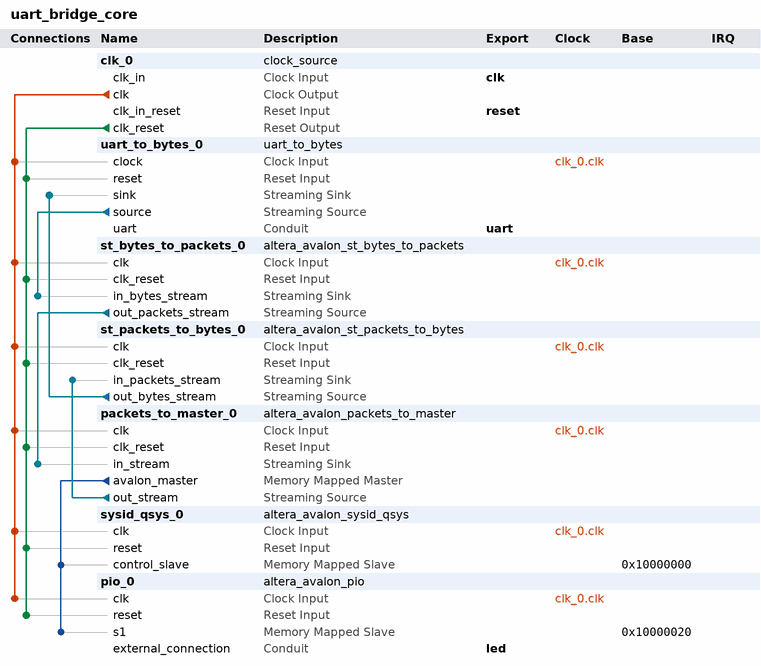
[diagram p0: system contents]
# Platform Designer (Qsys) system uart_bridge_core, Cyclone IV E EP4CE6E22C8
# Parameters at their usual value, and those the tool derives, are not listed.
package require -exact qsys 22.1
create_system uart_bridge_core
set_project_property DEVICE_FAMILY {Cyclone IV E}
set_project_property DEVICE EP4CE6E22C8

add_instance clk_0 clock_source 22.1
set_instance_parameter_value clk_0 clockFrequency 50000000

add_instance uart_to_bytes_0 uart_to_bytes 1.0
set_instance_parameter_value uart_to_bytes_0 CLOCK_FREQUENCY 50000000
set_instance_parameter_value uart_to_bytes_0 UART_BAUDRATE 115200
set_instance_parameter_value uart_to_bytes_0 UART_STOPBIT 1

add_instance st_bytes_to_packets_0 altera_avalon_st_bytes_to_packets 22.1
set_instance_parameter_value st_bytes_to_packets_0 CHANNEL_WIDTH 8
set_instance_parameter_value st_bytes_to_packets_0 ENCODING 0

add_instance st_packets_to_bytes_0 altera_avalon_st_packets_to_bytes 22.1
set_instance_parameter_value st_packets_to_bytes_0 CHANNEL_WIDTH 8
set_instance_parameter_value st_packets_to_bytes_0 ENCODING 0

add_instance packets_to_master_0 altera_avalon_packets_to_master 22.1
set_instance_parameter_value packets_to_master_0 EXPORT_MASTER_SIGNALS 0
set_instance_parameter_value packets_to_master_0 FAST_VER 0
set_instance_parameter_value packets_to_master_0 FIFO_DEPTHS 2

add_instance sysid_qsys_0 altera_avalon_sysid_qsys 22.1
set_instance_parameter_value sysid_qsys_0 id 1923088385

add_instance pio_0 altera_avalon_pio 22.1
set_instance_parameter_value pio_0 direction Output
set_instance_parameter_value pio_0 width 2

# connections
add_connection clk_0.clk packets_to_master_0.clk clock
add_connection clk_0.clk pio_0.clk clock
add_connection clk_0.clk st_bytes_to_packets_0.clk clock
add_connection clk_0.clk st_packets_to_bytes_0.clk clock
add_connection clk_0.clk sysid_qsys_0.clk clock
add_connection clk_0.clk uart_to_bytes_0.clock clock
add_connection clk_0.clk_reset packets_to_master_0.clk_reset reset
add_connection clk_0.clk_reset pio_0.reset reset
add_connection clk_0.clk_reset st_bytes_to_packets_0.clk_reset reset
add_connection clk_0.clk_reset st_packets_to_bytes_0.clk_reset reset
add_connection clk_0.clk_reset sysid_qsys_0.reset reset
add_connection clk_0.clk_reset uart_to_bytes_0.reset reset
add_connection packets_to_master_0.avalon_master pio_0.s1 avalon
set_connection_parameter_value packets_to_master_0.avalon_master/pio_0.s1 baseAddress 0x10000020
add_connection packets_to_master_0.avalon_master sysid_qsys_0.control_slave avalon
set_connection_parameter_value packets_to_master_0.avalon_master/sysid_qsys_0.control_slave baseAddress 0x10000000
add_connection packets_to_master_0.out_stream st_packets_to_bytes_0.in_packets_stream avalon_streaming
add_connection st_bytes_to_packets_0.out_packets_stream packets_to_master_0.in_stream avalon_streaming
add_connection st_packets_to_bytes_0.out_bytes_stream uart_to_bytes_0.sink avalon_streaming
add_connection uart_to_bytes_0.source st_bytes_to_packets_0.in_bytes_stream avalon_streaming

# exported interfaces
add_interface clk clock sink
set_interface_property clk EXPORT_OF clk_0.clk_in
add_interface led conduit end
set_interface_property led EXPORT_OF pio_0.external_connection
add_interface reset reset sink
set_interface_property reset EXPORT_OF clk_0.clk_in_reset
add_interface uart conduit end
set_interface_property uart EXPORT_OF uart_to_bytes_0.uart

set_interconnect_requirement {$system} qsys_mm.clockCrossingAdapter HANDSHAKE
set_interconnect_requirement {$system} qsys_mm.enableEccProtection FALSE
set_interconnect_requirement {$system} qsys_mm.insertDefaultSlave FALSE
set_interconnect_requirement {$system} qsys_mm.maxAdditionalLatency 1

save_system uart_bridge_core.qsys
